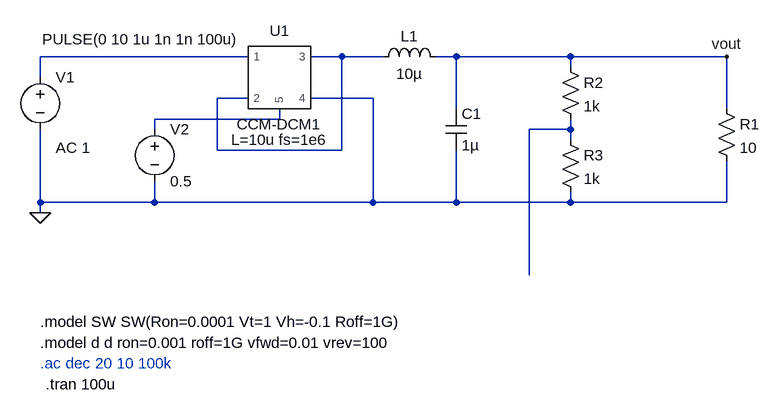
[diagram p0: schematic closed-loop-buck-fb.asc]
closed-loop-buck-fb.asc, the LTspice schematic file:
Version 4
SHEET 1 1492 680
WIRE 176 112 -144 112
WIRE 320 112 272 112
WIRE 384 112 320 112
WIRE 496 112 464 112
WIRE 672 112 496 112
WIRE 912 112 672 112
WIRE 672 128 672 112
WIRE -144 144 -144 112
WIRE 176 176 128 176
WIRE 368 176 272 176
WIRE 496 192 496 112
WIRE 912 192 912 112
WIRE 224 208 224 192
WIRE 224 208 32 208
WIRE 32 224 32 208
WIRE 672 224 672 208
WIRE 672 224 608 224
WIRE 672 240 672 224
WIRE 128 256 128 176
WIRE 320 256 320 112
WIRE 320 256 128 256
WIRE -144 336 -144 224
WIRE 32 336 32 304
WIRE 32 336 -144 336
WIRE 368 336 368 176
WIRE 368 336 32 336
WIRE 496 336 496 256
WIRE 496 336 368 336
WIRE 672 336 672 320
WIRE 672 336 496 336
WIRE 912 336 912 272
WIRE 912 336 672 336
WIRE -144 352 -144 336
WIRE 608 448 608 224
FLAG -144 352 0
FLAG 912 112 vout
SYMBOL voltage -144 128 R0
WINDOW 123 24 124 Left 2
WINDOW 39 0 0 Left 0
WINDOW 3 3 -43 Left 2
SYMATTR Value2 AC 1
SYMATTR Value PULSE(0 10 1u 1n 1n 100u)
SYMATTR InstName V1
SYMBOL ind 368 128 R270
WINDOW 0 32 56 VTop 2
WINDOW 3 5 56 VBottom 2
SYMATTR InstName L1
SYMATTR Value 10µ
SYMBOL cap 480 192 R0
SYMATTR InstName C1
SYMATTR Value 1µ
SYMBOL res 896 176 R0
SYMATTR InstName R1
SYMATTR Value 10
SYMBOL AutoGenerated\\CCM-DCM1 224 144 R0
SYMATTR InstName U1
SYMBOL voltage 32 208 R0
WINDOW 123 0 0 Left 0
WINDOW 39 0 0 Left 0
SYMATTR InstName V2
SYMATTR Value 0.5
SYMBOL res 656 112 R0
SYMATTR InstName R2
SYMATTR Value 1k
SYMBOL res 656 224 R0
SYMATTR InstName R3
SYMATTR Value 1k
TEXT -144 520 Left 2 !.model SW SW(Ron=0.0001 Vt=1 Vh=-0.1 Roff=1G)
TEXT -144 552 Left 2 !.model d d ron=0.001 roff=1G vfwd=0.01 vrev=100
TEXT -144 584 Left 2 ;.ac dec 20 10 100k
TEXT -136 616 Left 2 !.tran 100u

The netlist it stands for:
* closed-loop-buck-fb.asc
V1 N001 0 PULSE(0 10 1u 1n 1n 100u) AC 1
L1 N002 vout 10µ
C1 vout 0 1µ
R1 vout 0 10
XU1 N001 N002 N002 0 N003 CCM-DCM1 L=10u fs=1e6  ; pins 1 2 3 4 5
V2 N003 0 0.5
R2 vout N004 1k
R3 N004 0 1k
.model SW SW(Ron=0.0001 Vt=1 Vh=-0.1 Roff=1G)
.model d d ron=0.001 roff=1G vfwd=0.01 vrev=100
* .ac dec 20 10 100k
.tran 100u
.lib CCM-DCM1.mod
.backanno
.end